# EAGLE design Entwurf1 (EAGLE 9.6.2)
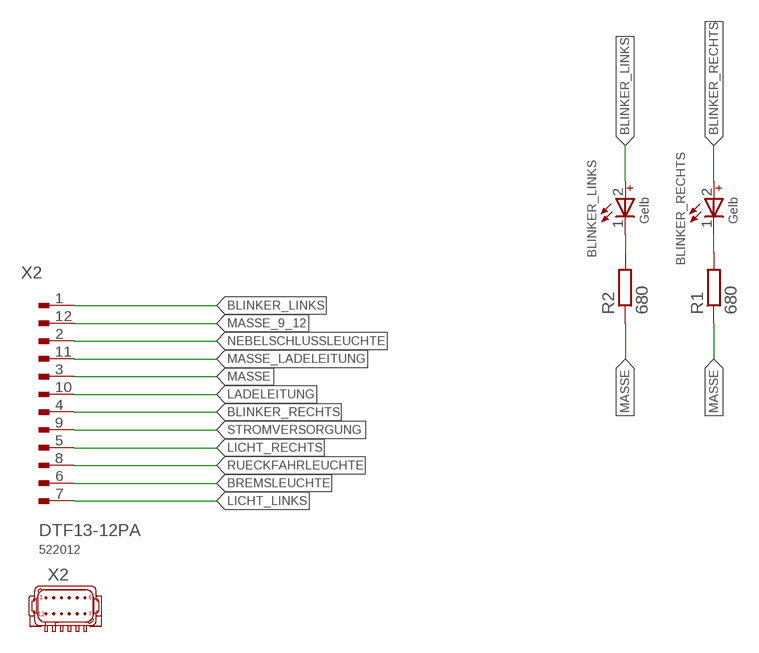
[diagram p0: schematic, sheet 1]

## Parts
BLINKER_LINKS  Gelb  WL-TMRW_5MM_151054GS03000_WITHOUTSTOPPER  [WL-TMRW_5MM]
BLINKER_RECHTS  Gelb  WL-TMRW_5MM_151054GS03000_WITHOUTSTOPPER  [WL-TMRW_5MM]
R1  680  R-EU_0204/7  [0204/7]
R2  680  R-EU_0204/7  [0204/7]
X2  DTF13-12PA  [DTF13-12PA]

## Nets
BLINKER_LINKS: BLINKER_LINKS.2(+) X2.1
BLINKER_RECHTS: BLINKER_RECHTS.2(+) X2.4
BREMSLEUCHTE: X2.6
LADELEITUNG: X2.10
LICHT_LINKS: X2.7
LICHT_RECHTS: X2.5
MASSE: R1.1 R2.1 X2.3
MASSE_9_12: X2.12
MASSE_LADELEITUNG: X2.11
N$3: BLINKER_LINKS.1(-) R2.2
N$5: BLINKER_RECHTS.1(-) R1.2
NEBELSCHLUSSLEUCHTE: X2.2
RUECKFAHRLEUCHTE: X2.8
STROMVERSORGUNG: X2.9

## Library data of the parts
BLINKER_LINKS BLINKER_RECHTS = Wurth_LEDs_WL-TMRW:WL-TMRW_5MM: WL-TMRW THT Mono-color Round Waterclear Characteristics Low energy consumption High reliability Low current requirement Fast switching No UV/IR radiation Easy installation Ultra high luminous efficacy Versatile mounting on PC boards With and without stopper Applications Indicator light Displays Traffic signal light Marker lights Commercial outdoor advertising Energy saving lamp Backlight LED Displays Electronic and optical indicator PBC mounted panel indicator Variable message sign <https://www.we-online.com/catalog/media/o14911v209%20Family_TMRW_THT.jpg> Details see: https://www.we-online.com/catalog/en/WL-TMRW/ Updated By Yingchun,Shan,2020-03-23 2020(C) Wurth Elektronik; ABSTRAHLWINKEL: 30°; CHIP-TECHNOLOGY: InGaN; DATASHEET-URL: https://www.we-online.com/catalog/datasheet/151054GS03000.pdf; EMITTING-COLOR: Green; I-V-TYP: 10000mcd; LAMDA-DOM-TYP: 522nm; LAMDA-PEAK-TYP: 515nm; PART-NUMBER: 151054GS03000; V-F-TYP: 3.4V
R1 R2 = resistor:R-EU_: RESISTOR, European symbol
X2 = DEUTSCH-PCB:DTF13-12PA: DTF13-12PA Connector System : Draht-an-Leiterplatte, Kabel-an-Gerät Alias NummerZPF000000000130557 Home-Page <http://www.te.com/deu-de/product-DTF13-12PA.html>; ARTIKEL_NR: 522012

## Board
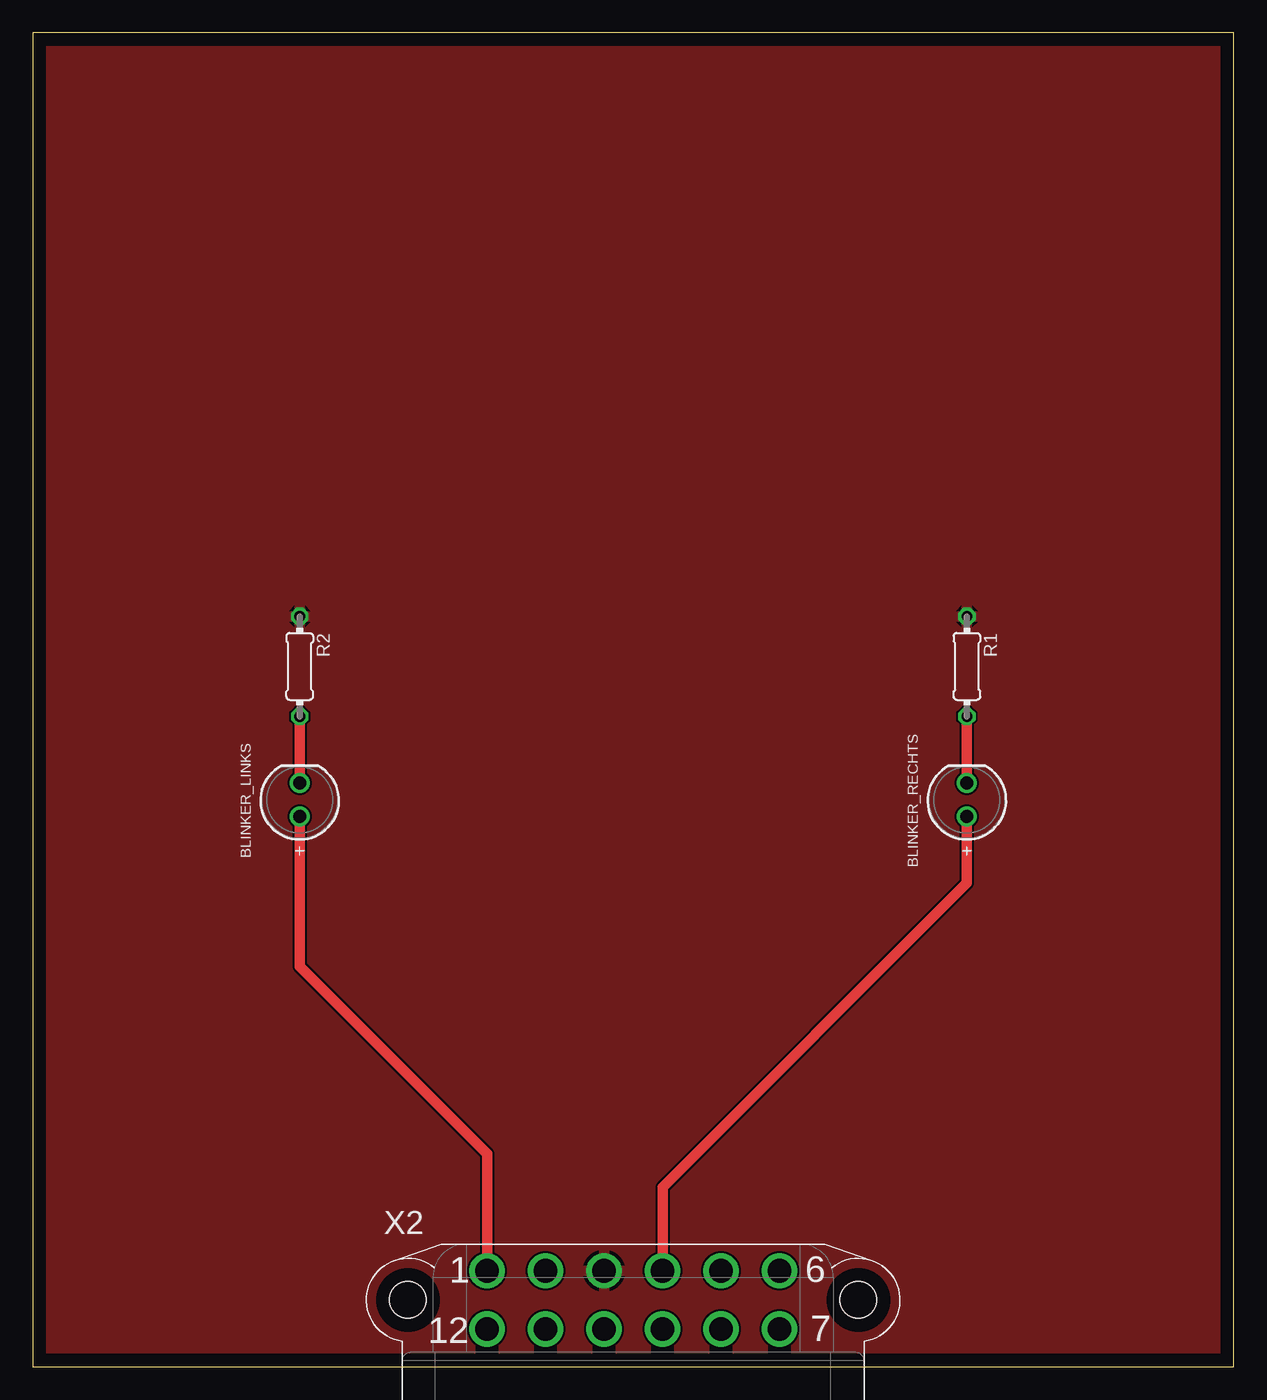
[diagram p1: board, top side]
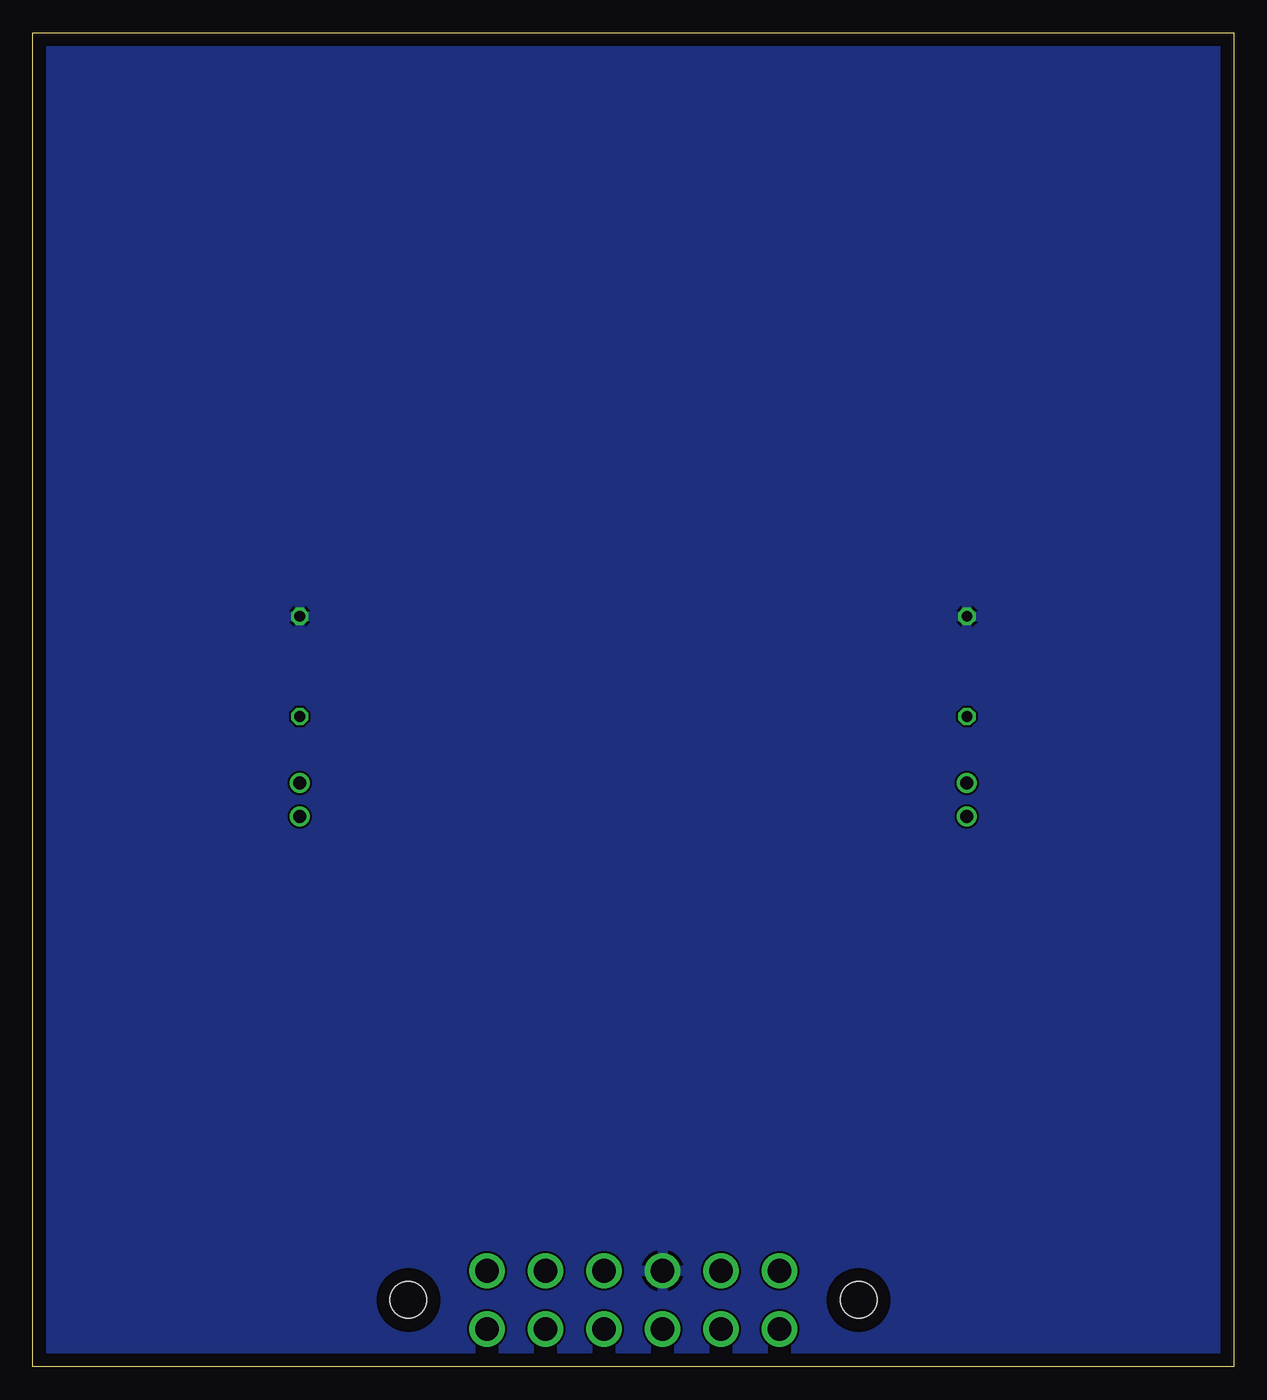
[diagram p2: board, bottom side, seen from below]

Size 91.44 x 101.6 mm. Coordinates in mm from the lower left corner, seen from the top.
Outline: 0,0 91.44,0 91.44,101.6 0,101.6 0,0
Copper layers (1*16): Top 0.035mm / dielectric 1.5mm / Bottom 0.035mm
Design rules "default": minimum track width 6mil, minimum drill 0.35mm, track to track 6mil, track to pad 6mil, pad to pad 6mil, via to via 6mil, smd to smd 6mil, copper to edge 40mil, drill to drill 6mil, minimum pad ring 10mil, minimum via ring 8mil, stop-mask expansion 4mil, vias tented up to drill 0mil, thermal gap 10mil

### Footprints (pad centres in the part's own frame; a part is rotated, then mirrored left to right if it is on the bottom)
WL-TMRW_5MM = drill 1: 1 1.27,0; 2 -1.27,0
0204/7 = drill 0.813 octagon: 1 -3.81,0; 2 3.81,0
DTF13-12PA = drill 1.8 pad 2.4: 1 -11.125,2.223; 2 -6.675,2.223; 3 -2.225,2.223; 4 2.225,2.223; 5 6.675,2.223; 6 11.125,2.223; 7 11.125,-2.223; 8 6.675,-2.223; 9 2.225,-2.223; 10 -2.225,-2.223; 11 -6.675,-2.223; 12 -11.125,-2.223 | hole 2.8: -17.157,0; 17.133,0

### Placement (x,y rotation side)
BLINKER_LINKS  20.32,43.18 90 top
BLINKER_RECHTS  71.12,43.18 90 top
R1  71.12,53.34 270 top
R2  20.32,53.34 270 top
X2  45.72,5.08 0 top

### Tracks (layer width: path | path; a pad name or v marks a point on that pad's centre or on a via)
BLINKER_LINKS
  Top 0.813: X2.1 34.59,16.2 20.32,30.48 BLINKER_LINKS.2
BLINKER_RECHTS
  Top 0.813: BLINKER_RECHTS.2 71.12,36.83 47.95,13.65 X2.4
MASSE
  pour Top: -5.08,106.68 96.52,106.68 96.52,-5.08 -5.08,-5.08
  pour Bottom: -5.08,106.68 96.52,106.68 96.52,-5.08 -5.08,-5.08
N$3
  Top 0.813: R2.2 BLINKER_LINKS.1
N$5
  Top 0.813: R1.2 BLINKER_RECHTS.1